# EAGLE schematic foxBMS_BMS-Interface (EAGLE 6.5.0)
AUTHOR: Fraunhofer IISB foxBMS Team; REL-DATE: 2017-05-09; TITLE: foxBMS BMS-Interface; VERSION: 1.1.0

## Sheet 1 of 5: Realisierung Jumper
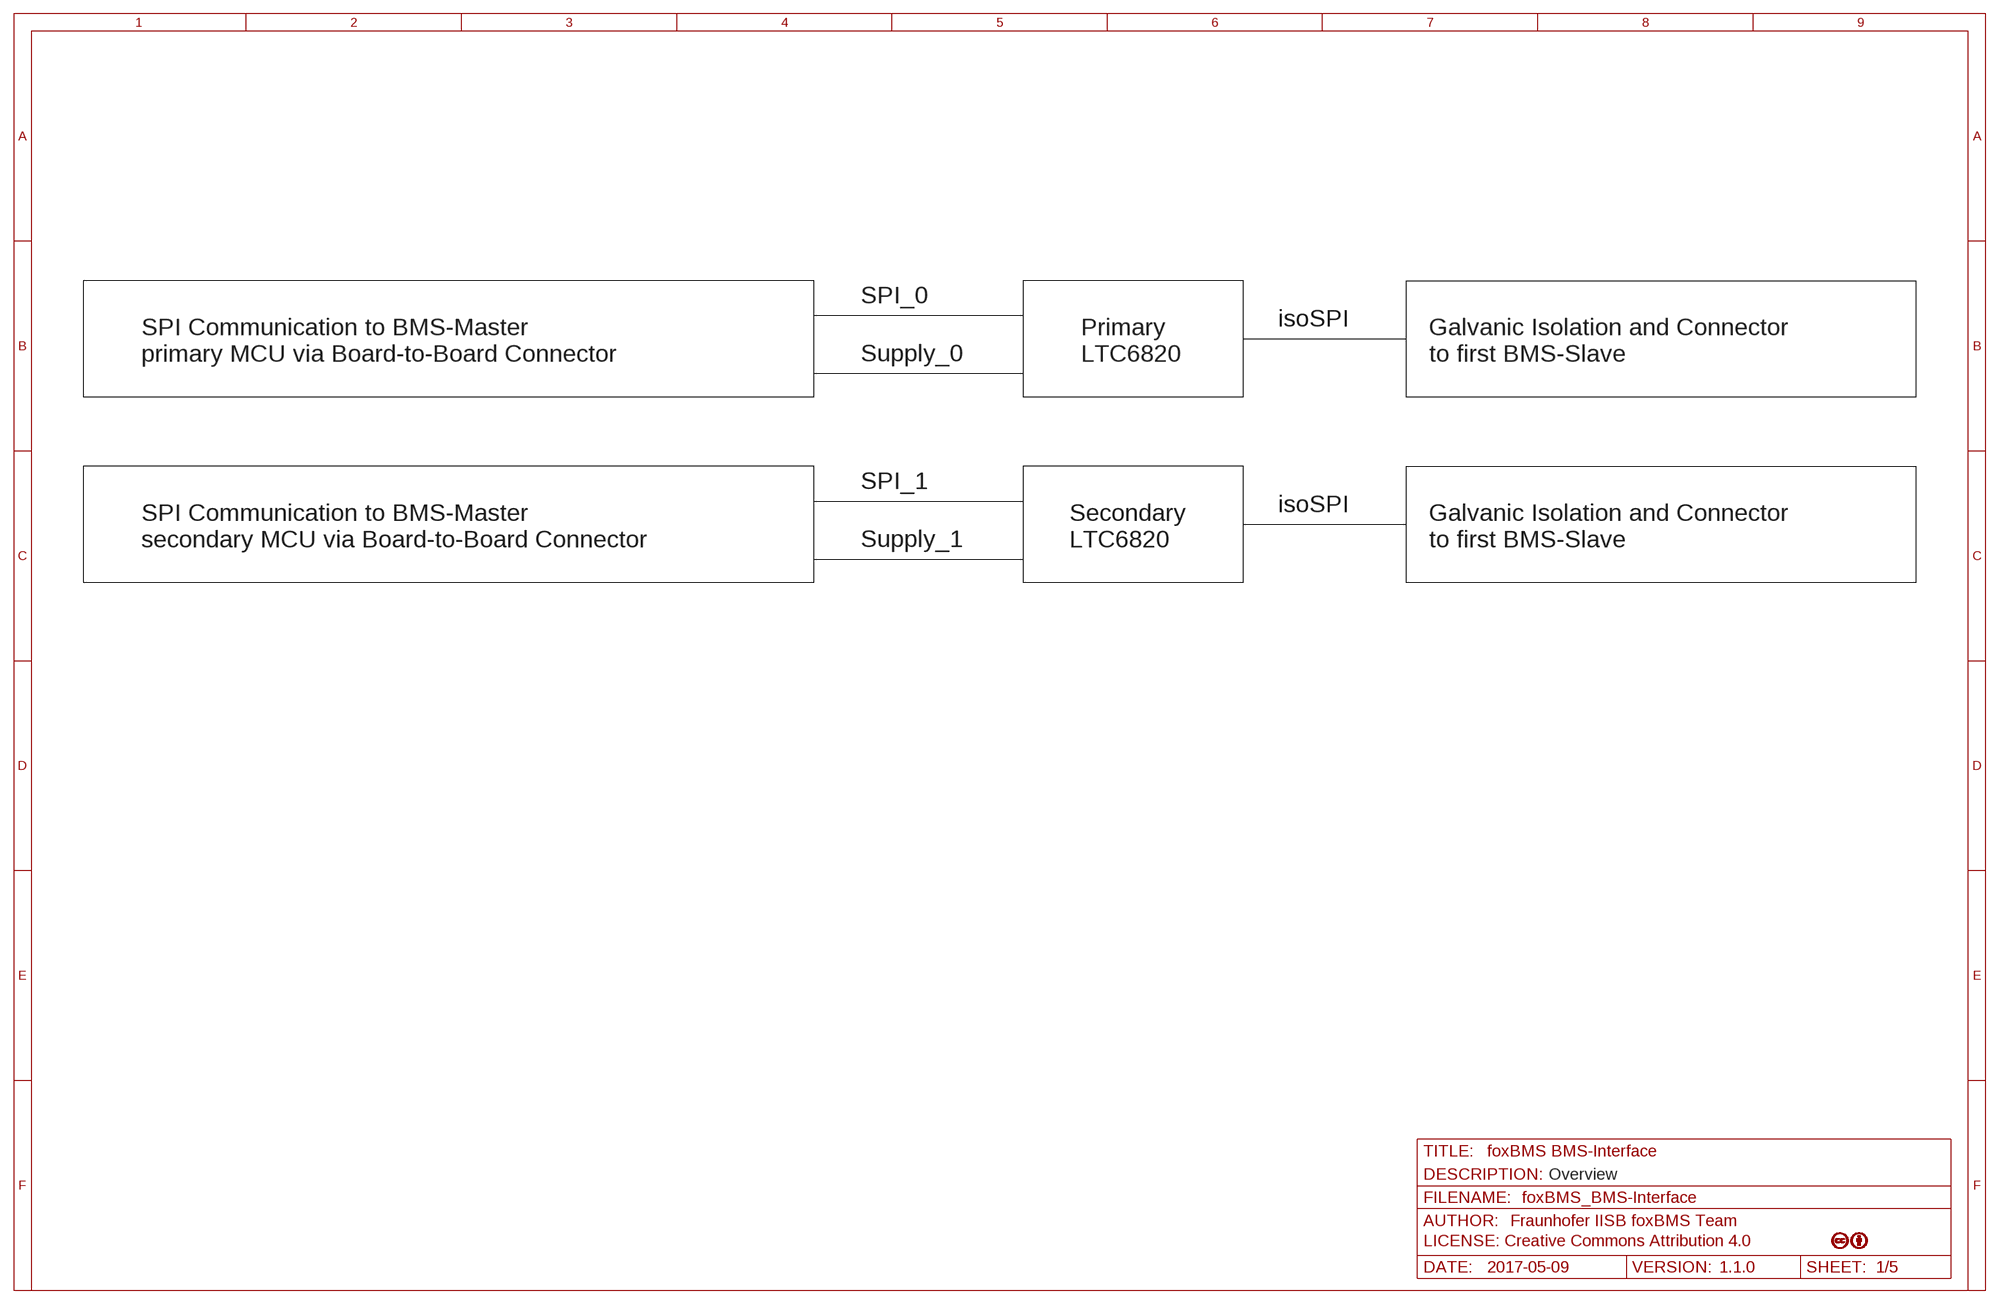
[diagram p0: schematic, sheet 1]

### Notes on the sheet
- SPI_0
- isoSPI
- SPI Communication to BMS-Master
  primary MCU via Board-to-Board Connector
- Supply_0
- Primary
  LTC6820
- Galvanic Isolation and Connector
  to first BMS-Slave
- SPI_1
- isoSPI
- SPI Communication to BMS-Master
  secondary MCU via Board-to-Board Connector
- Supply_1
- Secondary
  LTC6820
- Galvanic Isolation and Connector
  to first BMS-Slave
- Overview

## Sheet 2 of 5
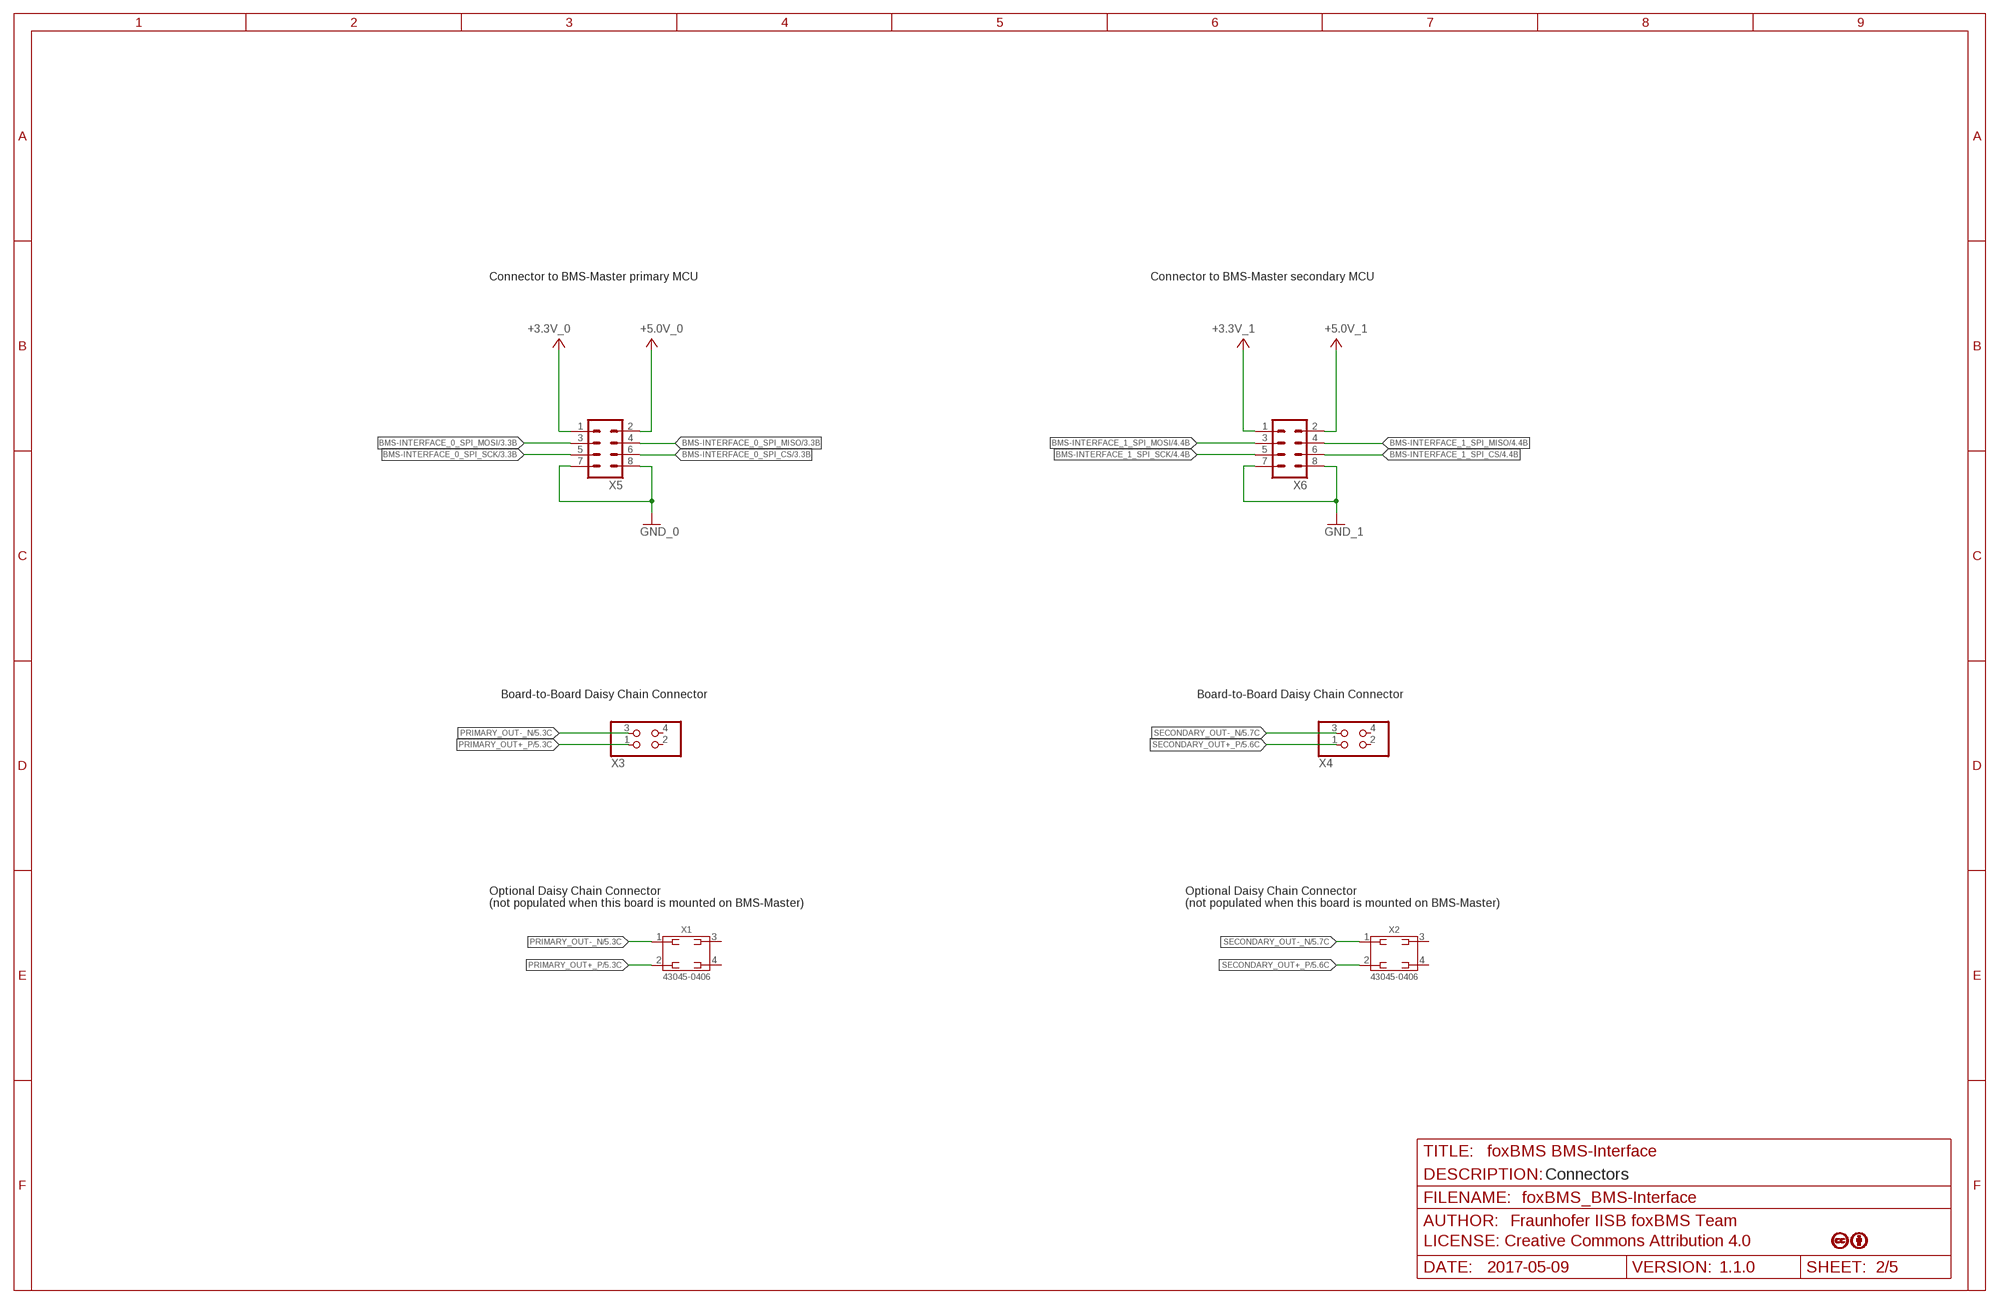
[diagram p1: schematic, sheet 2]

### Parts
X1  43045-0406_MOLEX_4PIN  [X_SMD_MOLEX_43045-0408_R_REV01]
X2  43045-0406_MOLEX_4PIN  [X_SMD_MOLEX_43045-0408_R_REV01]
X3  PINHD-2X2  [2X02]
X4  PINHD-2X2  [2X02]
X5  MA04-2  [MA04-2]
X6  MA04-2  [MA04-2]

### Nets
+3.3V_0: X5.1 ; also sheet 3
+3.3V_1: X6.1 ; also sheet 4
+5.0V_0: X5.2
+5.0V_1: X6.2
BMS-INTERFACE_0_SPI_CS: X5.6 ; also sheet 3
BMS-INTERFACE_0_SPI_MISO: X5.4 ; also sheet 3
BMS-INTERFACE_0_SPI_MOSI: X5.3 ; also sheet 3
BMS-INTERFACE_0_SPI_SCK: X5.5 ; also sheet 3
BMS-INTERFACE_1_SPI_CS: X6.6 ; also sheet 4
BMS-INTERFACE_1_SPI_MISO: X6.4 ; also sheet 4
BMS-INTERFACE_1_SPI_MOSI: X6.3 ; also sheet 4
BMS-INTERFACE_1_SPI_SCK: X6.5 ; also sheet 4
GND_0: X5.7 X5.8 ; also sheet 3,5
GND_1: X6.7 X6.8 ; also sheet 4,5
PRIMARY_OUT+_P [DiffPair]: X1.2 X3.1 ; also sheet 5
PRIMARY_OUT-_N [DiffPair]: X1.1 X3.3 ; also sheet 5
SECONDARY_OUT+_P: X2.2 X4.1 ; also sheet 5
SECONDARY_OUT-_N: X2.1 X4.3 ; also sheet 5
Unconnected: X1.3 X1.4 X2.3 X2.4 X3.2 X3.4 X4.2 X4.4

### Notes on the sheet
- Connector to BMS-Master primary MCU | Connector to BMS-Master secondary MCU
- Board-to-Board Daisy Chain Connector | Board-to-Board Daisy Chain Connector
- Optional Daisy Chain Connector
  (not populated when this board is mounted on BMS-Master)
- Optional Daisy Chain Connector
  (not populated when this board is mounted on BMS-Master)
- Connectors

## Sheet 3 of 5: IC 1
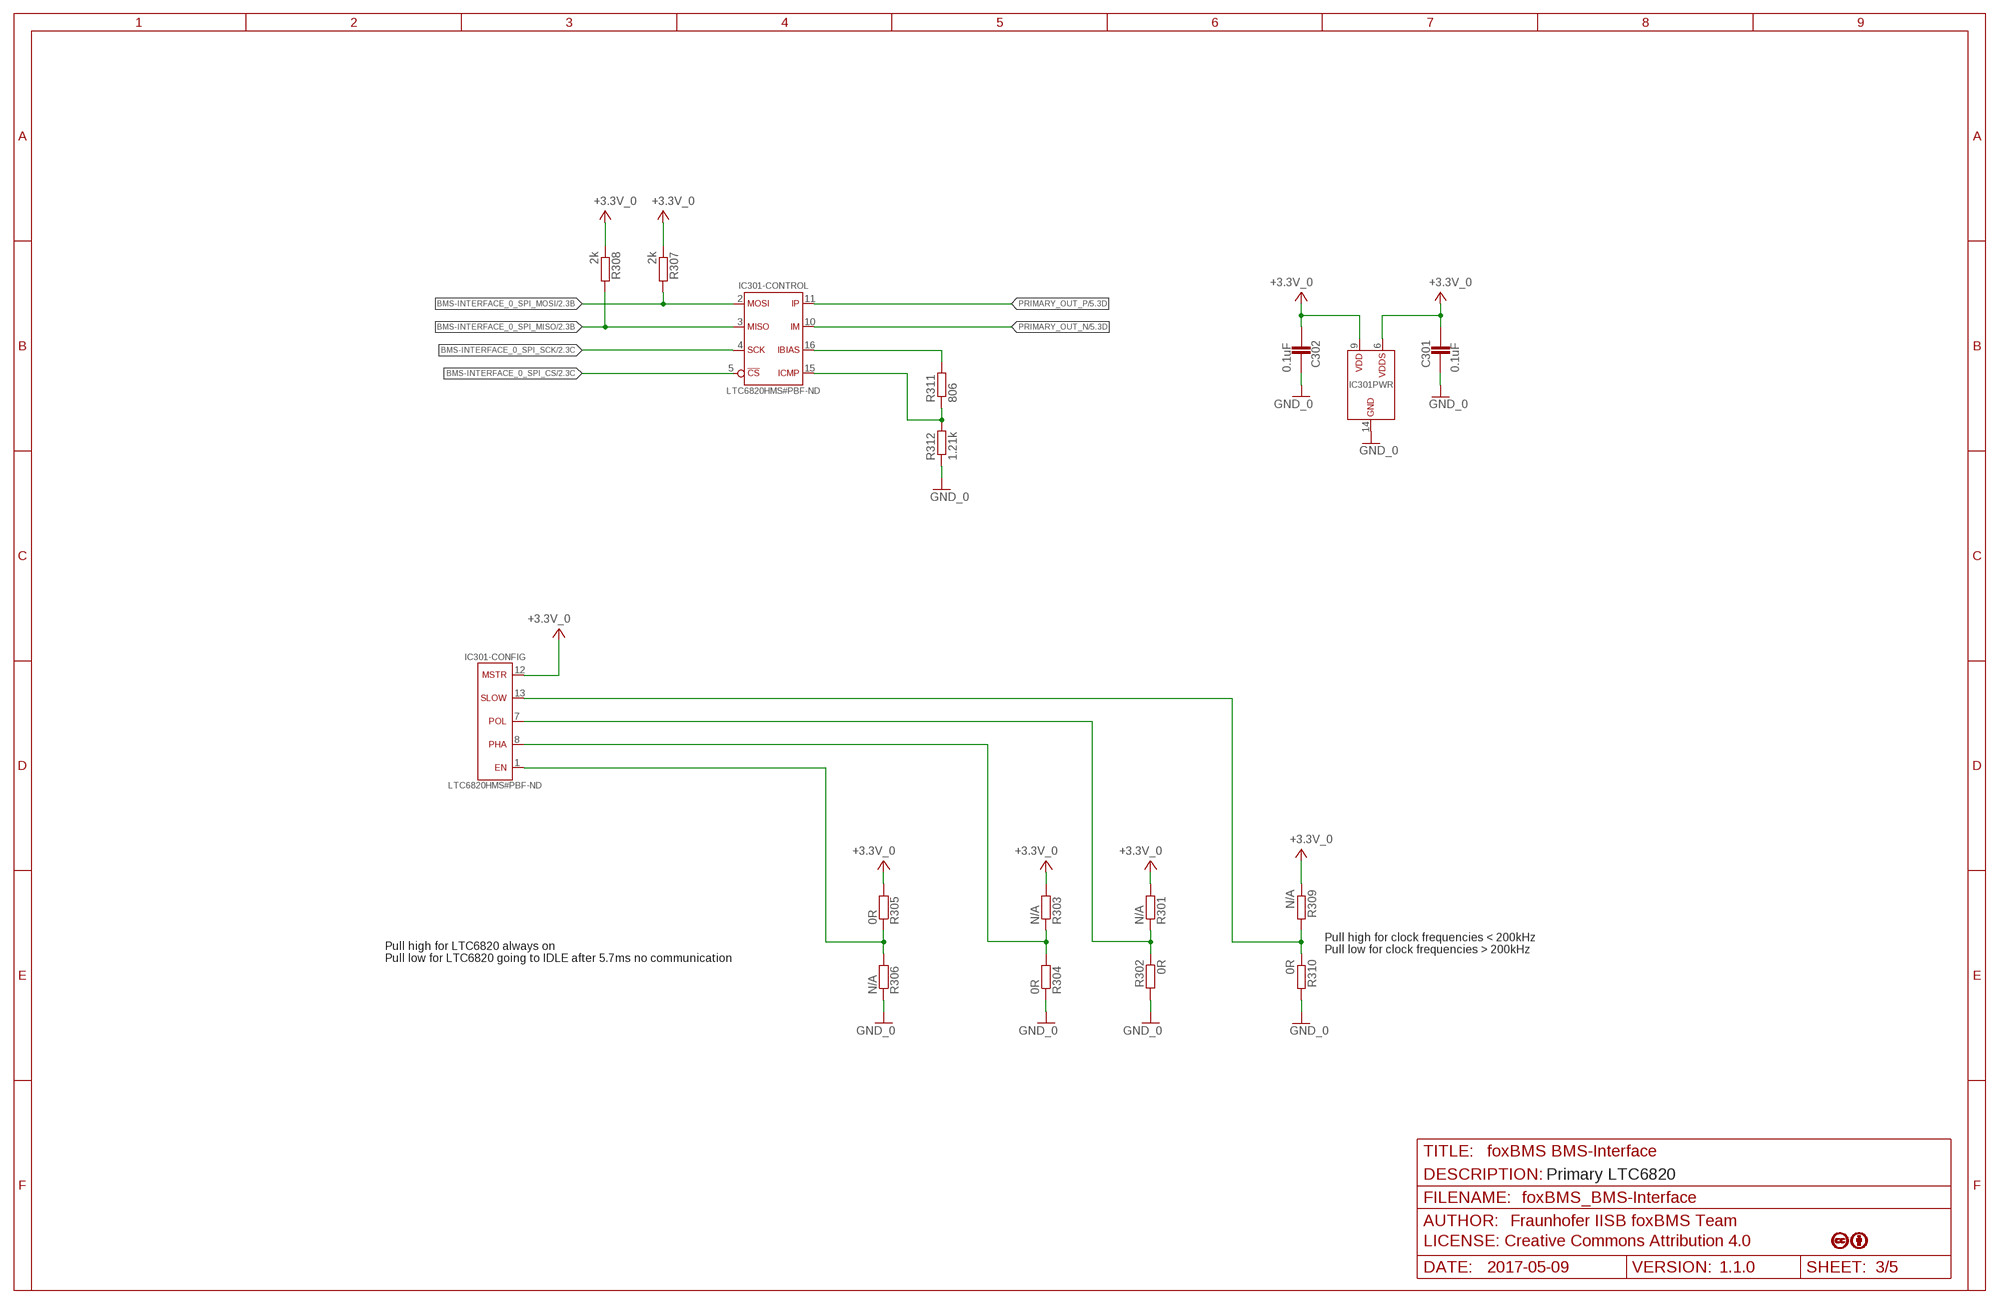
[diagram p2: schematic, sheet 3]

### Parts
C301  0.1uF  C_NP0_0603  [0603]
C302  0.1uF  C_NP0_0603  [0603]
IC301  LTC6820HMS#PBF  [IC_SMD_MSOP-16_(MS16)_R_LINEAR_REV01]
R301  N/A  R_MET_0603  [0603]
R302  0R  R_MET_0603  [0603]
R303  N/A  R_MET_0603  [0603]
R304  0R  R_MET_0603  [0603]
R305  0R  R_MET_0603  [0603]
R306  N/A  R_MET_0603  [0603]
R307  2k  R_MET_0603  [0603]
R308  2k  R_MET_0603  [0603]
R309  N/A  R_MET_0603  [0603]
R310  0R  R_MET_0603  [0603]
R311  806  R_MET_0603  [0603]
R312  1.21k  R_MET_0603  [0603]

### Nets
+3.3V_0: C301.2 C302.2 IC301.6(PWR:VDDS) IC301.9(PWR:VDD) IC301.12(-CONFIG:MSTR) R301.2 R303.2 R305.2 R307.1 R308.1 R309.1 ; also sheet 2
BMS-INTERFACE_0_SPI_CS: IC301.5(-CONTROL:!CS) ; also sheet 2
BMS-INTERFACE_0_SPI_MISO: IC301.3(-CONTROL:MISO) R308.2 ; also sheet 2
BMS-INTERFACE_0_SPI_MOSI: IC301.2(-CONTROL:MOSI) R307.2 ; also sheet 2
BMS-INTERFACE_0_SPI_SCK: IC301.4(-CONTROL:SCK) ; also sheet 2
EN-BACKUP: IC301.1(-CONFIG:EN) R305.1 R306.2
GND_0: C301.1 C302.1 IC301.14(PWR:GND) R302.2 R304.1 R306.1 R310.2 R312.1 ; also sheet 2,5
N$13: IC301.16(-CONTROL:IBIAS) R311.2
N$15: IC301.15(-CONTROL:ICMP) R311.1 R312.2
PHA-PRIMARY: IC301.8(-CONFIG:PHA) R303.1 R304.2
POL-PRIMARY: IC301.7(-CONFIG:POL) R301.1 R302.1
PRIMARY_OUT_N [DiffPair]: IC301.10(-CONTROL:IM) ; also sheet 5
PRIMARY_OUT_P [DiffPair]: IC301.11(-CONTROL:IP) ; also sheet 5
SLOW-PRIMARY: IC301.13(-CONFIG:SLOW) R309.2 R310.1

### Notes on the sheet
- Pull high for LTC6820 always on
  Pull low for LTC6820 going to IDLE after 5.7ms no communication
- Pull high for clock frequencies < 200kHz
  Pull low for clock frequencies > 200kHz
- Primary LTC6820

## Sheet 4 of 5: IC2
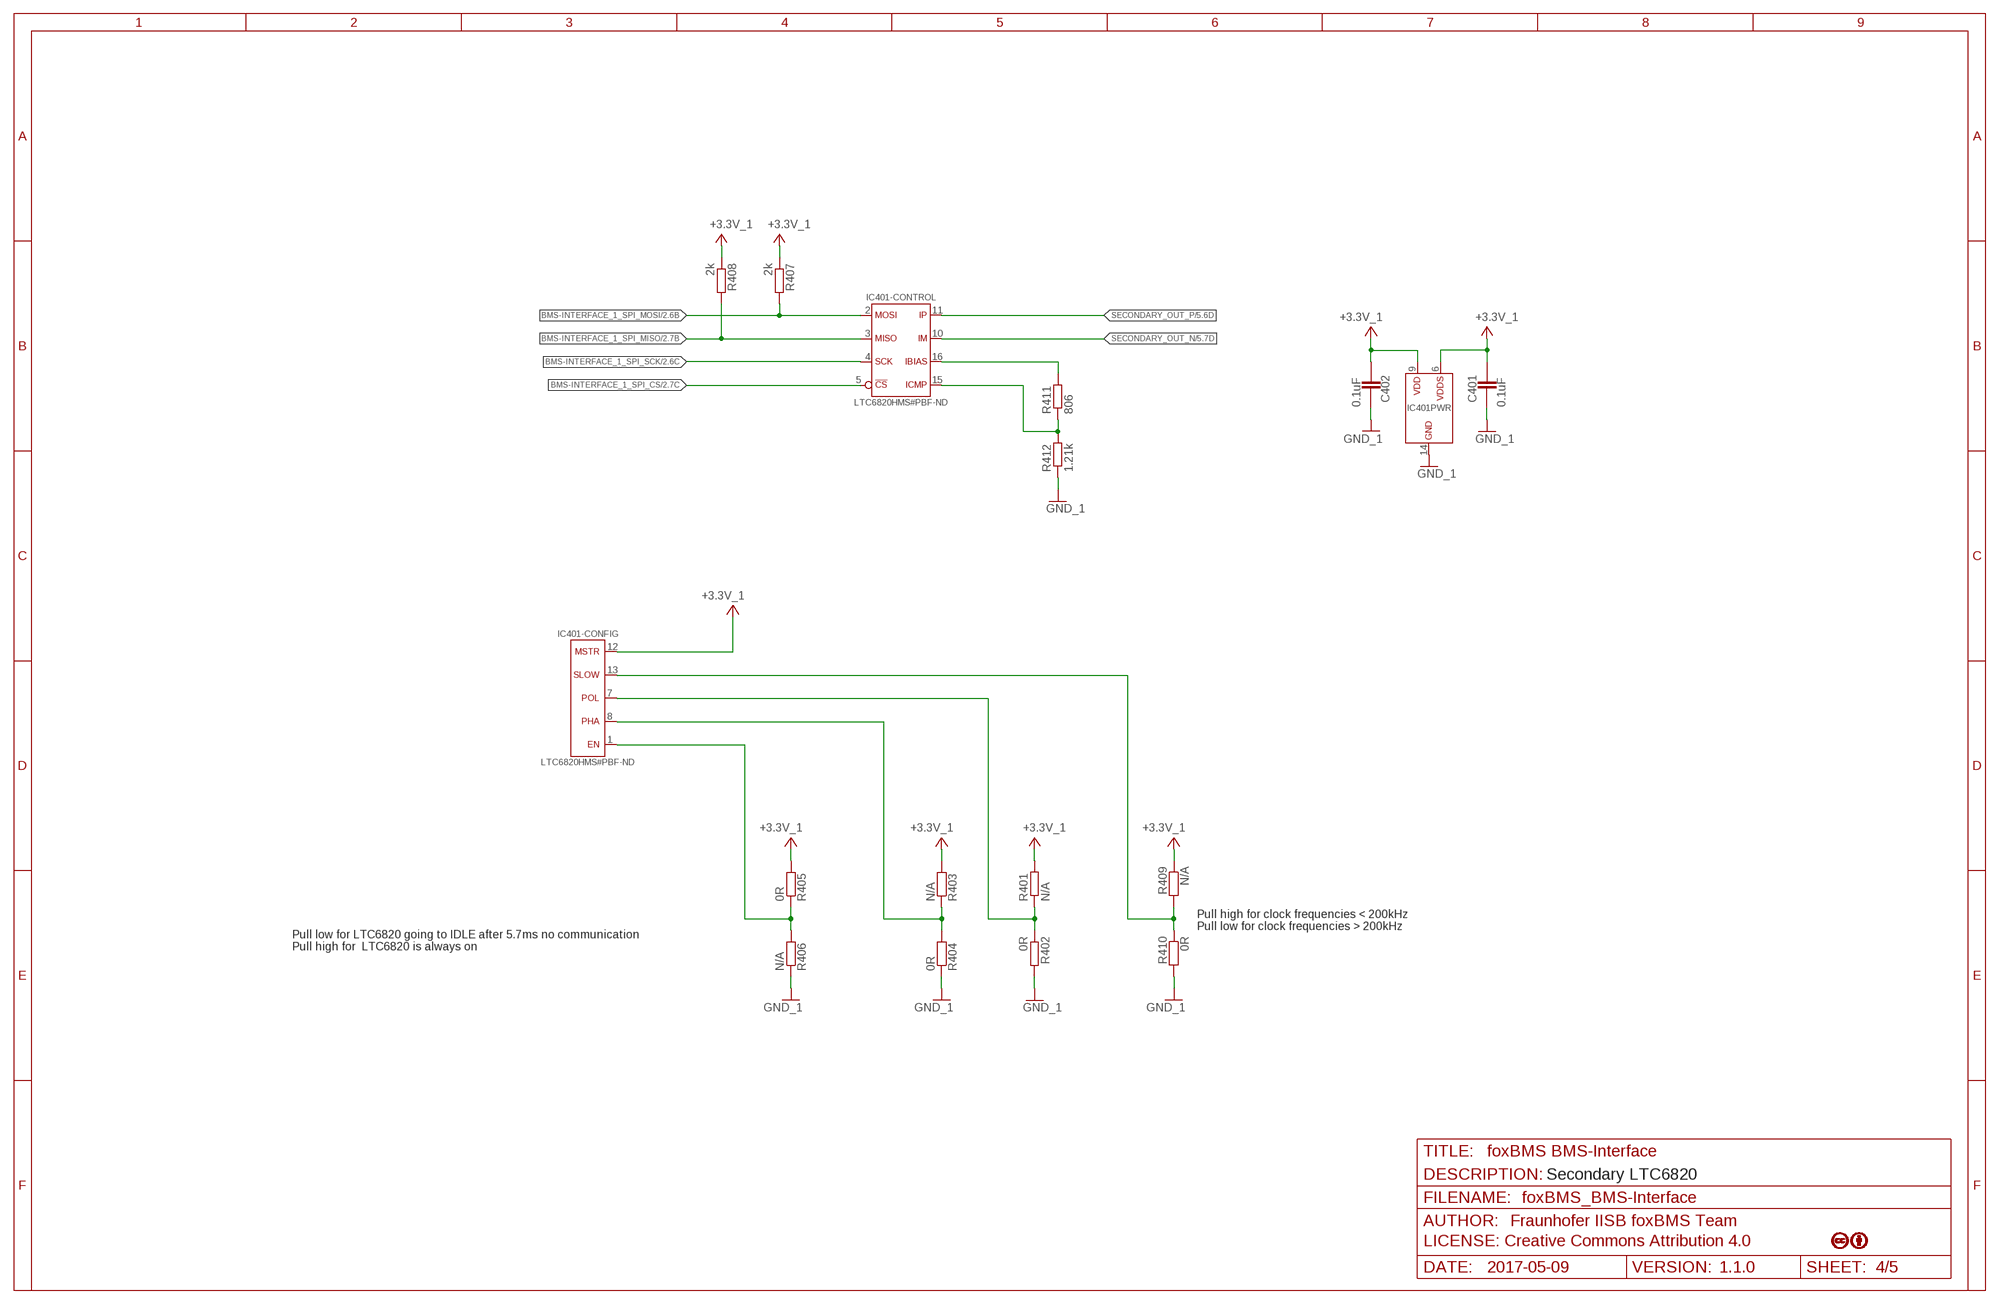
[diagram p3: schematic, sheet 4]

### Parts
C401  0.1uF  C_NP0_0603  [0603]
C402  0.1uF  C_NP0_0603  [0603]
IC401  LTC6820HMS#PBF  [IC_SMD_MSOP-16_(MS16)_R_LINEAR_REV01]
R401  N/A  R_MET_0603  [0603]
R402  0R  R_MET_0603  [0603]
R403  N/A  R_MET_0603  [0603]
R404  0R  R_MET_0603  [0603]
R405  0R  R_MET_0603  [0603]
R406  N/A  R_MET_0603  [0603]
R407  2k  R_MET_0603  [0603]
R408  2k  R_MET_0603  [0603]
R409  N/A  R_MET_0603  [0603]
R410  0R  R_MET_0603  [0603]
R411  806  R_MET_0603  [0603]
R412  1.21k  R_MET_0603  [0603]

### Nets
+3.3V_1: C401.2 C402.2 IC401.6(PWR:VDDS) IC401.9(PWR:VDD) IC401.12(-CONFIG:MSTR) R401.2 R403.2 R405.2 R407.1 R408.1 R409.1 ; also sheet 2
BMS-INTERFACE_1_SPI_CS: IC401.5(-CONTROL:!CS) ; also sheet 2
BMS-INTERFACE_1_SPI_MISO: IC401.3(-CONTROL:MISO) R408.2 ; also sheet 2
BMS-INTERFACE_1_SPI_MOSI: IC401.2(-CONTROL:MOSI) R407.2 ; also sheet 2
BMS-INTERFACE_1_SPI_SCK: IC401.4(-CONTROL:SCK) ; also sheet 2
EN-BACKUP1: IC401.1(-CONFIG:EN) R405.1 R406.2
GND_1: C401.1 C402.1 IC401.14(PWR:GND) R402.2 R404.1 R406.1 R410.2 R412.1 ; also sheet 2,5
N$1: IC401.15(-CONTROL:ICMP) R411.1 R412.2
N$4: IC401.16(-CONTROL:IBIAS) R411.2
PHA-SECONDARY: IC401.8(-CONFIG:PHA) R403.1 R404.2
POL-SECONDARY: IC401.7(-CONFIG:POL) R401.1 R402.1
SECONDARY_OUT_N: IC401.10(-CONTROL:IM) ; also sheet 5
SECONDARY_OUT_P: IC401.11(-CONTROL:IP) ; also sheet 5
SLOW-SECONDARY: IC401.13(-CONFIG:SLOW) R409.2 R410.1

### Notes on the sheet
- Pull low for LTC6820 going to IDLE after 5.7ms no communication
  Pull high for  LTC6820 is always on
- Pull high for clock frequencies < 200kHz
  Pull low for clock frequencies > 200kHz
- Secondary LTC6820

## Sheet 5 of 5: Stecker
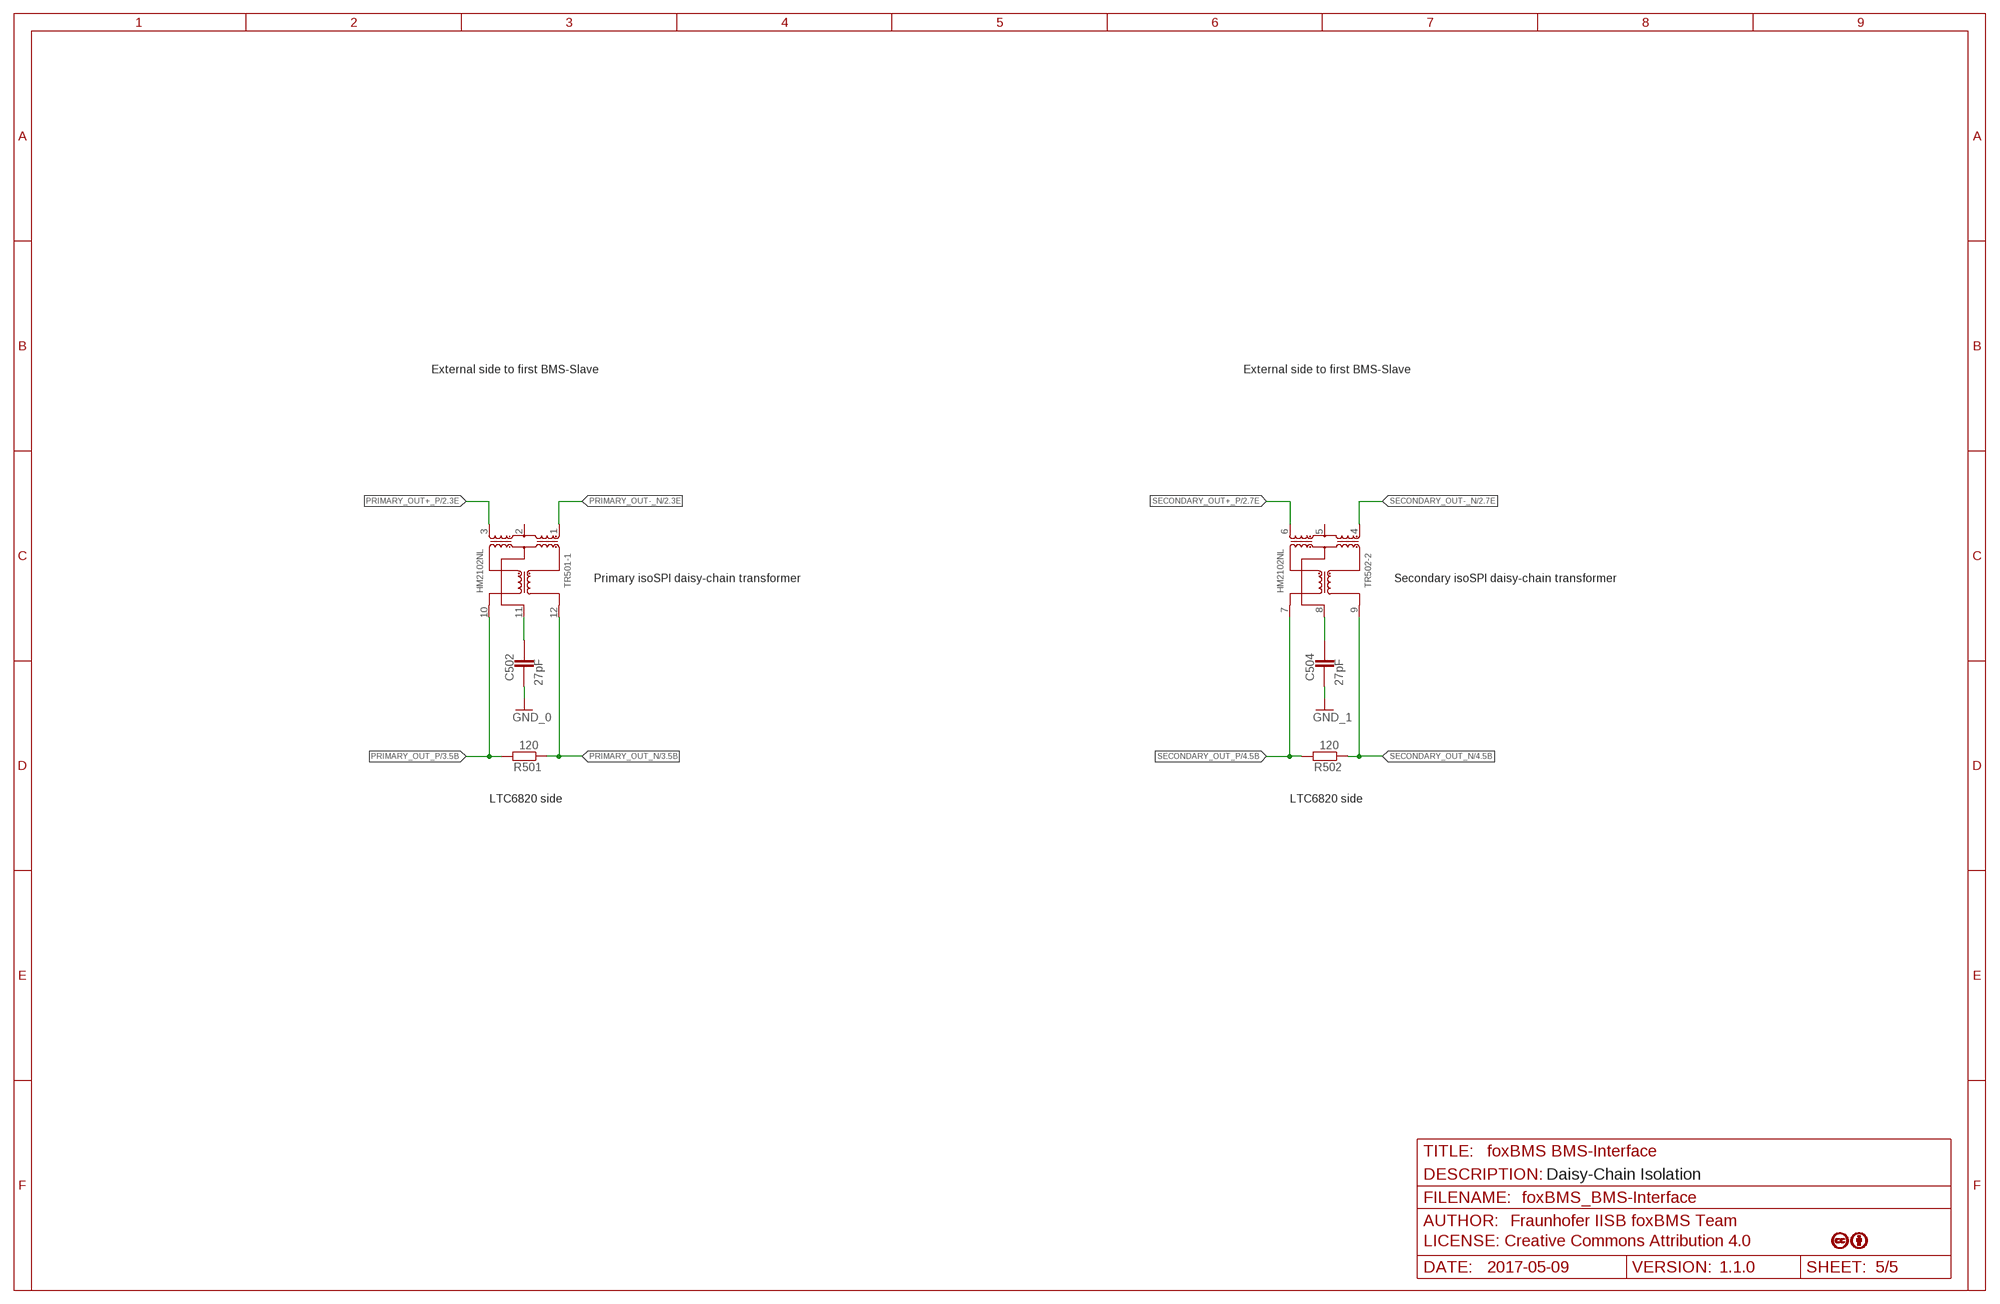
[diagram p4: schematic, sheet 5]

### Parts
C502  27pF  C_NP0_0603  [0603]
C504  27pF  C_NP0_0603  [0603]
R501  120  R_MET_0603  [0603]
R502  120  R_MET_0603  [0603]
TR501  HM2102NL  [HM2102NL]
TR502  HM2102NL  [HM2102NL]

### Nets
GND_0: C502.1 ; also sheet 2,3
GND_1: C504.1 ; also sheet 2,4
N$2: C502.2 TR501.11(-1:CMT)
N$21: C504.2 TR502.8(-2:CMT)
PRIMARY_OUT+_P [DiffPair]: TR501.3(-1:D-) ; also sheet 2
PRIMARY_OUT-_N [DiffPair]: TR501.1(-1:D+) ; also sheet 2
PRIMARY_OUT_N [DiffPair]: R501.1 TR501.12(-1:X+) ; also sheet 3
PRIMARY_OUT_P [DiffPair]: R501.2 TR501.10(-1:X-) ; also sheet 3
SECONDARY_OUT+_P: TR502.6(-2:D-) ; also sheet 2
SECONDARY_OUT-_N: TR502.4(-2:D+) ; also sheet 2
SECONDARY_OUT_N: R502.1 TR502.9(-2:X+) ; also sheet 4
SECONDARY_OUT_P: R502.2 TR502.7(-2:X-) ; also sheet 4
Unconnected: TR501.2(-1:CT) TR501.4(-2:D+) TR501.5(-2:CT) TR501.6(-2:D-) TR501.7(-2:X-) TR501.8(-2:CMT) TR501.9(-2:X+) TR502.1(-1:D+) TR502.2(-1:CT) TR502.3(-1:D-) TR502.5(-2:CT) TR502.10(-1:X-) TR502.11(-1:CMT) TR502.12(-1:X+)

### Notes on the sheet
- External side to first BMS-Slave | External side to first BMS-Slave
- Primary isoSPI daisy-chain transformer | Secondary isoSPI daisy-chain transformer
- LTC6820 side | LTC6820 side
- Daisy-Chain Isolation

## Library data of the parts
C301 C302 C401 C402 C502 C504 = custom_passiv:C*: Kondensator Bitte gleich beim Einfügen vorgesehenen Werkstoff auswählen. 0402 NP0: #2759 0402 X7R: #1977 0402 Y5V: #2761 0603 X7R: #191 0603 Y5V: #497 0805 NP0: #74 0805 X7R: #104 1206 NP0: #102 1206 X7R: #98 1210 X7R: #114 1812 X7R: #335
IC301 IC401 = 0_LES_SCHNITTSTELLEN-IC.SMD.ISO-TRANSCEIVER:LTC6820*?: LTC6820 - Linear Technology Datasheet www <http://cds.linear.com/docs/en/datasheet/6820fa.pdf> Datasheet local <file:///C:\Eagle-Datasheet\Schnittstellen-IC\LTC6820_Linear.pdf> isoSPI Isolated Communications Interface - 1Mbps Isolated SPI Data Communications - Simple Galvanic Isolation Using Standard Transformers - Bidirectional Interface Over a Single Twisted Pair - Supports Cable Lengths Up to 100 Meters - Very Low EMI Susceptibility and Emissions - Configurable for High Noise Immunity or Low Power - Engineered for ISO26262 Compliant Systems - Requires No Software Changes in Most SPI Systems - Ultralow, 2μA Idle Current - Automatic Wake-Up Detection - Operating Temperature Range: –40°C to 125°C - 2.7V to 5.5V Power Supply - Interfaces to All Logic from 1.7V to 5.5V - Available in 16-Lead QFN and MSOP Packages Revision Date changed by Changes ------------------------------------------------------------------------------------------ V1.0 21.04.2016 SC Ersterstellung; DISTRI_1: Digi-Key; DISTRI_1-NR: LTC6820HMS#PBF-ND; DISTRI_1-PREIS: 4,82€; HERSTELLER: Linear Technology; HERSTELLER-NR: LTC6820HMS#PBF-ND; MARKING: 6820; PDF-LOCAL: file:///C:\Eagle-Datasheet\Schnittstellen-IC\LTC6820_Linear.pdf; SIZE: MSOP-16; UIDD_TYP: 6,00µA; UKAT: I; UTERM: Sn; UTMAX: 125°C; UTMIN: -40°C; UTYP: ISO-Transceiver; UVAL: LTC6820HMS#PBF-ND; UVDDS_MAX: 5,50V; UVDDS_MIN: 1,70V; UVDD_MAX: 5,50V; UVDD_MIN: 2,70V
R301-R312 R401-R412 R501 R502 = custom_passiv:R*: Widerstand: Bitte gleich beim Einfügen vorgesehenen Werkstoff wählen. 0R_0402: #2765 0R_0603: #2227 0R_0805: #2229 Met_0402: #2767 Met_0603: #801 Met_0805: #1095 Met_1206: #1389 Met_MINIMELF: #1683 MET_E96_0402: #2769 MET_E96_0603: #5 MET_E96_0805: #1230 MET_E96_1206: #286 MET_E96_MICROMELF: #1979 MET_E96_MINIMELF: #536
TR501 TR502 = transformer_custom:HM2102NL; UVAL: HM2102NL
X1 X2 = 0_LES_STECKVERBINDUNG.SMD.RASTER_3,00MM.BUCHSE:43045-040?*_MOLEX_4PIN: 43045-Serie - MOLEX 43045-0406 Datasheet www <http://www.molex.com/webdocs/datasheets/pdf/en-us/0430450406_PCB_HEADERS.pdf> Datasheet local <file:///C:\Eagle-Datasheet\Steckverbindung\430450406_Molex.pdf> 43045-0407 Datasheet www <http://www.molex.com/webdocs/datasheets/pdf/en-us/0430450407_PCB_HEADERS.pdf> Datasheet local <file:///C:\Eagle-Datasheet\Steckverbindung\430450407_Molex.pdf> 43045-0408 Datasheet www <http://www.molex.com/webdocs/datasheets/pdf/en-us/0430450408_PCB_HEADERS.pdf> Datasheet local <file:///C:\Eagle-Datasheet\Steckverbindung\430450408_Molex.pdf> - 4-Pin Buchse - liegend - Package - 2 reihig x 2-Pins - Size: 15,40mm x 9,65mm x 10,29mm - RM: 3,00mm - Farbe: Schwarz - Material: High Temperature Thermoplastic Revision Date changed by Changes ------------------------------------------------------------------------------------------ V1.0 17.12.2015 SC Ersterstellung; DISTRI_1: Mouser; DISTRI_1-NR: 538-43045-0406; DISTRI_1-PREIS: 2,22€; DISTRI_2: Digi-Key; DISTRI_2-NR: WM3249CT-ND; DISTRI_2-PREIS: 2,34€; HERSTELLER: Molex; HERSTELLER-NR: 43045-0406; PDF-LOCAL: file:///C:\Eagle-Datasheet\Steckverbindung\430450406_Molex.pdf; SIZE: 15,40mm x 6,65mm x 10,29mm; UCOLOR: Schwarz; UIN_MAX: 5,00A; UKAT: C; UMAT: High Temperature Thermoplastic; URISO: 1,00GOhm; UTERM: Sn; UTERMPLAT: 254nm; UTMAX: 105°C; UTMIN: -40°C; UTYP: Buchse; UVAL: 43045-0406; UVCC_MAX: 600V
X3 X4 = pinhead:PINHD-2X2: PIN HEADER
X5 X6 = foxBMS_BMS-Interface_V1.1_MW:MA04-2: PIN HEADER; OC_FARNELL: unknown; OC_NEWARK: unknown

## Net classes
0 default: width 0.152 mm, clearance 0.152 mm
1 DiffPair: width 0.254 mm, clearance 0.152 mm